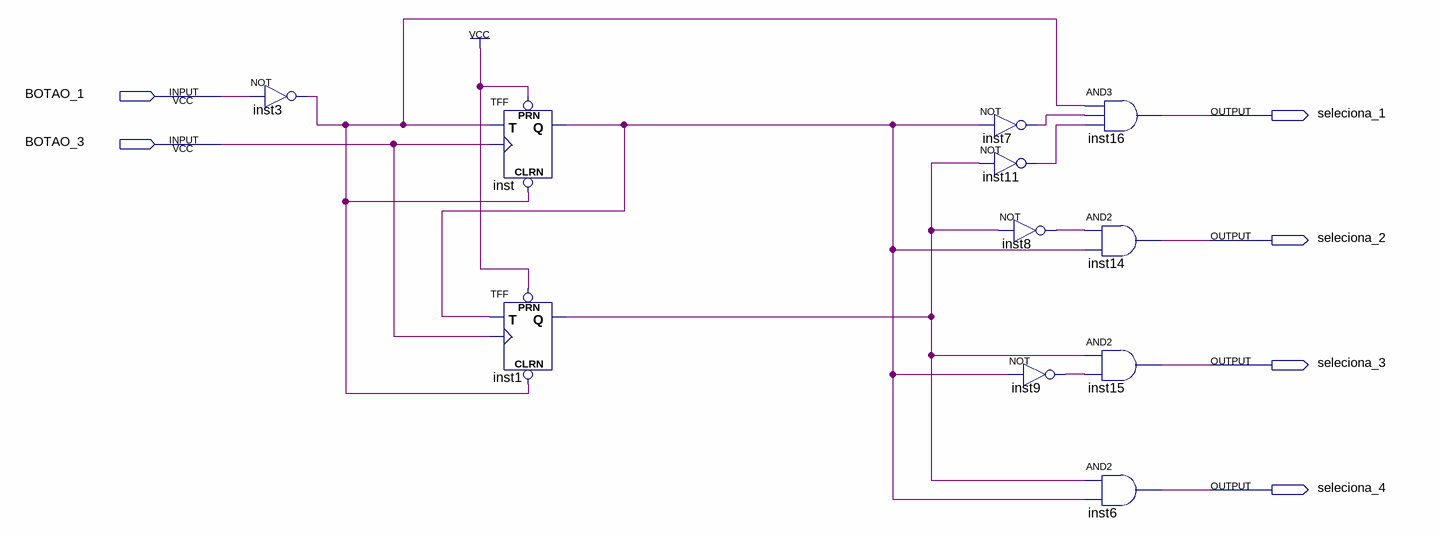
[diagram p0: schematic sheet]
// Quartus schematic ALTERAcaO_DISPLAY.bdf as structural Verilog: 11 symbols, 6 pins
module ALTERAcaO_DISPLAY (
  input  BOTAO_1,
  input  BOTAO_3,
  output seleciona_1,
  output seleciona_2,
  output seleciona_3,
  output seleciona_4
);

  wire inst1_q, inst3_out, inst7_out, inst8_out, inst9_out, inst11_out, inst_q;

  not inst3 (inst3_out, BOTAO_1);
  TFF inst (.PRN(1'b1), .CLRN(inst3_out), .T(inst3_out), .CLK(BOTAO_3), .Q(inst_q));
  TFF inst1 (.PRN(1'b1), .CLRN(inst3_out), .T(inst_q), .CLK(BOTAO_3), .Q(inst1_q));
  not inst7 (inst7_out, inst_q);
  not inst11 (inst11_out, inst1_q);
  not inst8 (inst8_out, inst1_q);
  not inst9 (inst9_out, inst_q);
  and inst16 (seleciona_1, inst3_out, inst7_out, inst11_out);
  and inst14 (seleciona_2, inst8_out, inst_q);
  and inst15 (seleciona_3, inst1_q, inst9_out);
  and inst6 (seleciona_4, inst1_q, inst_q);
endmodule
